# Altium project led_ring.PrjPcb
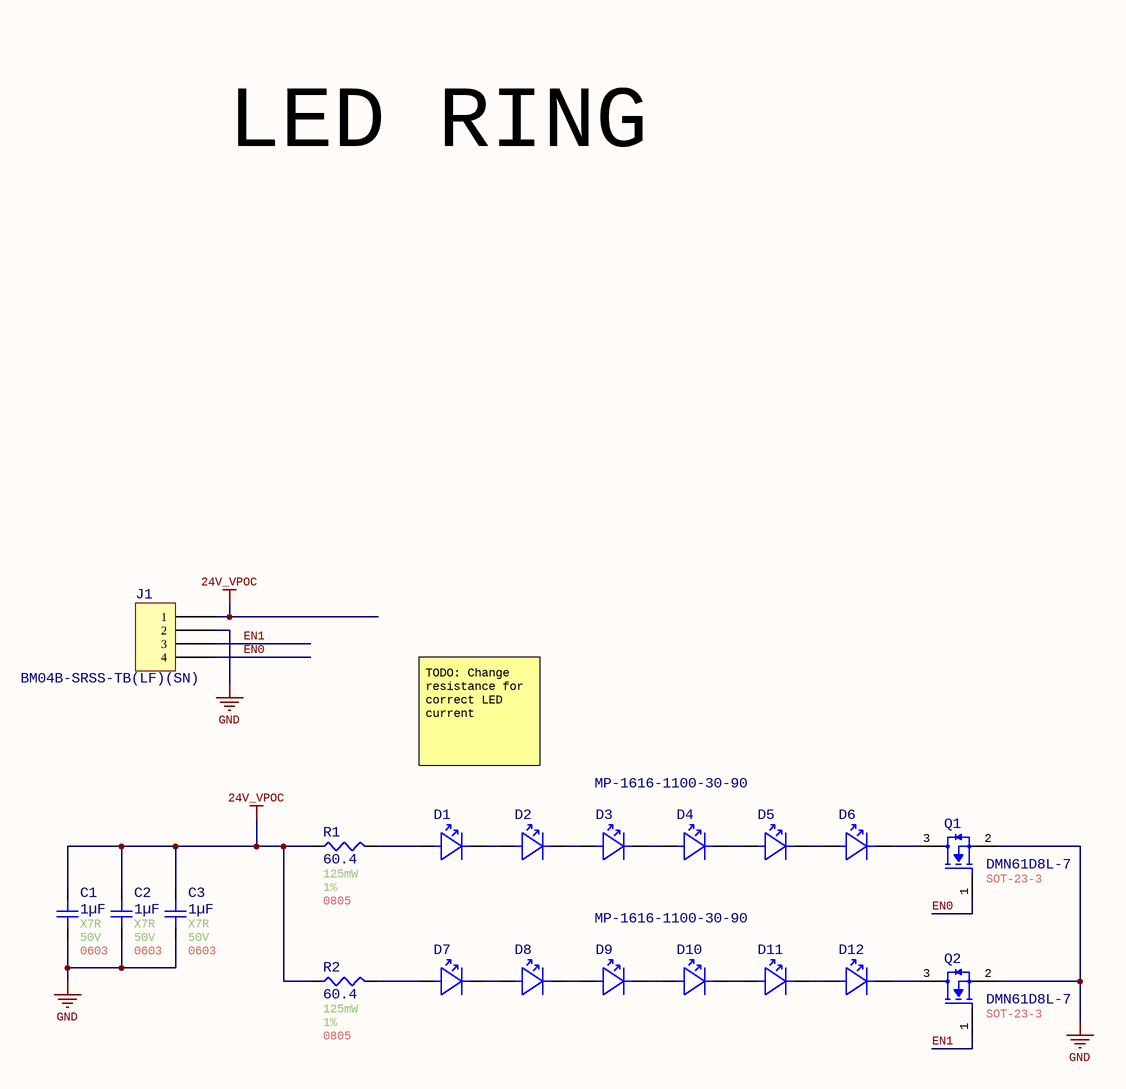
[diagram p0: Top.SchDoc]
PCBRevision: 0.0.1; ProjectTitle: Project; RR_PlaceNear: [{"paramVis":true,"a":{"refdes":"C6","srcUid":"OYVOCBFH","pin":"2"},"b":{"refdes":"U2","srcUid":"WNTCGATW","pin":"26"},"mm":5},{"paramVis":true,"a":{"refdes":"C7","srcUid":"CVMGOHLT","pin":"2"},"b":{"refdes":"U2","srcUid":"WNTCGATW","pin":"26"},"mm":5},{"paramVis":true,"a":{"refdes":"C8","srcUid":"TGPROSQA","pin":"2"},"b":{"refdes":"U2","srcUid":"WNTCGATW","pin":"26"},"mm":5},{"paramVis":true,"a":{"refdes":"C9","srcUid":"NERXMEEB","pin":"2"},"b":{"refdes":"U2","srcUid":"WNTCGATW","pin":"15"},"mm":5},{"paramVis":true,"a":{"refdes":"C10","srcUid":"PVQVEPHI","pin":"2"},"b":{"refdes":"U2","srcUid":"WNTCGATW","pin":"15"},"mm":5},{"paramVis":true,"a":{"refdes":"C11","srcUid":"IXZAQWUA","pin":"2"},"b":{"refdes":"U2","srcUid":"WNTCGATW","pin":"15"},"mm":5},{"paramVis":true,"a":{"refdes":"C12","srcUid":"SJIUUMFM","pin":"2"},"b":{"refdes":"U2","srcUid":"WNTCGATW","pin":"10"},"mm":5},{"paramVis":true,"a":{"refdes":"C13","srcUid":"VZIHORBA","pin":"2"},"b":{"refdes":"U2","srcUid":"WNTCGATW","pin":"10"},"mm":5},{"paramVis":true,"a":{"refdes":"C14","srcUid":"JKNMRYLV","pin":"2"},"b":{"refdes":"U2","srcUid":"WNTCGATW","pin":"10"},"mm":5},{"paramVis":true,"a":{"refdes":"C16","srcUid":"VAZDDXWB","pin":"2"},"b":{"refdes":"U2","srcUid":"WNTCGATW","pin":"25"},"mm":5},{"paramVis":true,"a":{"refdes":"C15","srcUid":"YTLVSWDQ","pin":"2"},"b":{"refdes":"U2","srcUid":"WNTCGATW","pin":"25"},"mm":5},{"paramVis":true,"a":{"refdes":"C18","srcUid":"XVSOHREA","pin":"2"},"b":{"refdes":"U2","srcUid":"WNTCGATW","pin":"16"},"mm":5},{"paramVis":true,"a":{"refdes":"C17","srcUid":"DALIXIOP","pin":"2"},"b":{"refdes":"U2","srcUid":"WNTCGATW","pin":"16"},"mm":5},{"paramVis":true,"a":{"refdes":"C20","srcUid":"WIZCYGLQ","pin":"2"},"b":{"refdes":"U2","srcUid":"WNTCGATW","pin":"11"},"mm":5},{"paramVis":true,"a":{"refdes":"C19","srcUid":"YZYSSQBB","pin":"2"},"b":{"refdes":"U2","srcUid":"WNTCGATW","pin":"11"},"mm":5},{"paramVis":true,"a":{"refdes":"C58","srcUid":"BEWWQTYO","pin":"1"},"b":{"refdes":"U2","srcUid":"WNTCGATW","pin":"9"},"mm":5},{"paramVis":true,"a":{"refdes":"C58","srcUid":"BEWWQTYO","pin":"2"},"b":{"refdes":"U2","srcUid":"WNTCGATW","pin":"11"},"mm":5}]; SchRevision: 0.1
1 sheet, 20 parts. Net scope: global (net labels, ports and power ports of the same name join across sheets).
Board file: led_ring.PcbDoc

## Sheet Top.SchDoc
size 431 x 279 mm; Author: Shivam Sharma; SheetNumber: 1; SheetTotal: 1; SheetRevision: 1.0

### Parts
C1  value 1µF  Temperature Coefficient: X7R  Voltage Rating: 50V  Case/Package: 0603  [Generic 0603 Capacitor]  (hidden comment: CGA3E3X7R1H105K080AB)
C2  value 1µF  Temperature Coefficient: X7R  Voltage Rating: 50V  Case/Package: 0603  [Generic 0603 Capacitor]  (hidden comment: CGA3E3X7R1H105K080AB)
C3  value 1µF  Temperature Coefficient: X7R  Voltage Rating: 50V  Case/Package: 0603  [Generic 0603 Capacitor]  (hidden comment: CGA3E3X7R1H105K080AB)
D1  MP-1616-1100-30-90  [1616_1.6x1.6x0.9_LED]
D2  MP-1616-1100-30-90  [1616_1.6x1.6x0.9_LED]  (value not drawn)
D3  MP-1616-1100-30-90  [1616_1.6x1.6x0.9_LED]  (value not drawn)
D4  MP-1616-1100-30-90  [1616_1.6x1.6x0.9_LED]  (value not drawn)
D5  MP-1616-1100-30-90  [1616_1.6x1.6x0.9_LED]  (value not drawn)
D6  MP-1616-1100-30-90  [1616_1.6x1.6x0.9_LED]  (value not drawn)
D7  MP-1616-1100-30-90  [1616_1.6x1.6x0.9_LED]
D8  MP-1616-1100-30-90  [1616_1.6x1.6x0.9_LED]  (value not drawn)
D9  MP-1616-1100-30-90  [1616_1.6x1.6x0.9_LED]  (value not drawn)
D10  MP-1616-1100-30-90  [1616_1.6x1.6x0.9_LED]  (value not drawn)
D11  MP-1616-1100-30-90  [1616_1.6x1.6x0.9_LED]  (value not drawn)
D12  MP-1616-1100-30-90  [1616_1.6x1.6x0.9_LED]  (value not drawn)
J1  BM04B-SRSS-TB(LF)(SN)  [JST BM04B-SRSS-TB]
Q1  DMN61D8L-7  Case/Package: SOT-23-3  [Diodes SOT23]
Q2  DMN61D8L-7  Case/Package: SOT-23-3  [Diodes SOT23]
R1  value 60.4  Power: 125mW  Tolerance: 1%  Case/Package: 0805  [0805 Resistor]  (hidden comment: TFA0805R60R4F-T5)
R2  value 60.4  Power: 125mW  Tolerance: 1%  Case/Package: 0805  [0805 Resistor]  (hidden comment: TFA0805R60R4F-T5)

### Nets
24V_VPOC: C1.2 C2.2 C3.2 J1.1 R1.1 R2.1
GND: C1.1 C2.1 C3.1 J1.2 Q1.2(SOURCE) Q2.2(SOURCE)
EN0: J1.4 Q1.1(GATE)
EN1: J1.3 Q2.1(GATE)
NetD1_1: D1.1(C) D2.2(A)
NetD1_2: D1.2(A) R1.2
NetD2_1: D2.1(C) D3.2(A)
NetD3_1: D3.1(C) D4.2(A)
NetD4_1: D4.1(C) D5.2(A)
NetD5_1: D5.1(C) D6.2(A)
NetD6_1: D6.1(C) Q1.3(DRAIN)
NetD7_1: D7.1(C) D8.2(A)
NetD7_2: D7.2(A) R2.2
NetD8_1: D8.1(C) D9.2(A)
NetD9_1: D9.1(C) D10.2(A)
NetD10_1: D10.1(C) D11.2(A)
NetD11_1: D11.1(C) D12.2(A)
NetD12_1: D12.1(C) Q2.3(DRAIN)

### Notes on the sheet
- LED RING
- TODO: Change resistance for correct LED current
- Title:
- Author:
- Approved:
- Size:
- Date:
- Git Hash:
- Sch Revision:
- B
- Prj:
- Sheet Revision:
- Variant:
- Edited:
- CONFIDENTIAL
- File:

### Library data of the parts
C1-C3 = CMP-001-00097-2: Automotive Grade, Mlcc, 0603, X7R, 5; Tolerance: 10%; AECQ: Yes; Capacitor Type: Ceramic; RoHS Compliant: Yes; Pins: 2; Max Operating Temperature: 125°C; Min Operating Temperature: -55°C
D1-D12 = CMP-007-00050-1: Single Color LED, Warm White, 1.6mm; Forward Voltage: 3.5V; Forward Current: 3.3A; Case/Package: 1616; Min Operating Temperature: -40°C; Pins: 2; Colour: White; Max Operating Temperature: 85°C
J1 = BM04B-SRSS-TB(LF)(SN): CONN HEADER SMD 4POS 1MM; Manufacturer: JST Sales America Inc.; Current Rating (Amps): 0.7A; Material Flammability Rating: UL94 V-0; Number of Positions: 4; Number of Positions Loaded: All; Pitch - Mating: 0.039" (1.00mm); Row Spacing - Mating: -25°C ~ 85°C; Shrouding: Shrouded - 4 Wall; Style: Board to Cable/Wire; Voltage Rating: 50V; Part Number: BM04B-SRSS-TB(LF)(SN); ComponentLink1Description: Datasheet; ComponentLink1URL: http://www.jst-mfg.com/product/pdf/eng/eSH.pdf; ComponentLink2Description: DigiKey Link; ComponentLink2URL: http://digikey.com/product-detail/en/jst-sales-america-inc/BM04B-SRSS-TB-LF-SN/455-1790-1-ND/926861; Connector Type: Header; Contact Finish - Mating: Tin; Contact Finish - Post: Tin; Contact Material: Copper Alloy; Contact Shape: Square; Contact Type: Male Pin; Fastening Type: Push-Pull; Features: Solder Retention; Insulation Color: Natural; Insulation Height: 0.167" (4.25mm); Insulation Material: Polyamide (PA), Nylon; LastUpdated: 8/24/2020 1:45:53 PM; Lifecycle Status: Active; Minimum Order: 1; Mounting Type: Surface Mount; Number of Rows: 1; Operating Temperature: -25°C ~ 85°C; Packaging: TapeAndReel; PartId: 16; Part Status: Active; Price: 0.29; Series: SR; Supplier 1: DigiKey; Supplier Part Number 1: 455-1790-1-ND; Termination: Solder
Q1 Q2 = CMP-013-00041-1: DMN61D8L Series 60 V 470 mA 1.8 Ohm Surface Mount N-Channel Mosfet - SOT-23-3; Transistor Type: n-FET; Mounting Technology: Surface Mount; RoHS Compliant: Yes; Min Operating Temperature: -55°C; Max Operating Temperature: 150°C
R1 R2 = CMP-009-00189-2: Res 60.4 Ohm 1% 1/8W 0805; AECQ: Yes; Pins: 2; Mounting Technology: SMD; Manufacturer Part Number: TFA0805R60R4F-T5

## Assembly variants
Main: all parts fitted